# Altium schematic sheet [03] CM4_PART1.SchDoc: Compute Module 4 (CM4)
size A3; Engineer: M. Folejewski; DocumentNumber: 3; SheetNumber: 3; SheetTotal: 5; PageSize: A3; Designators: 100-199
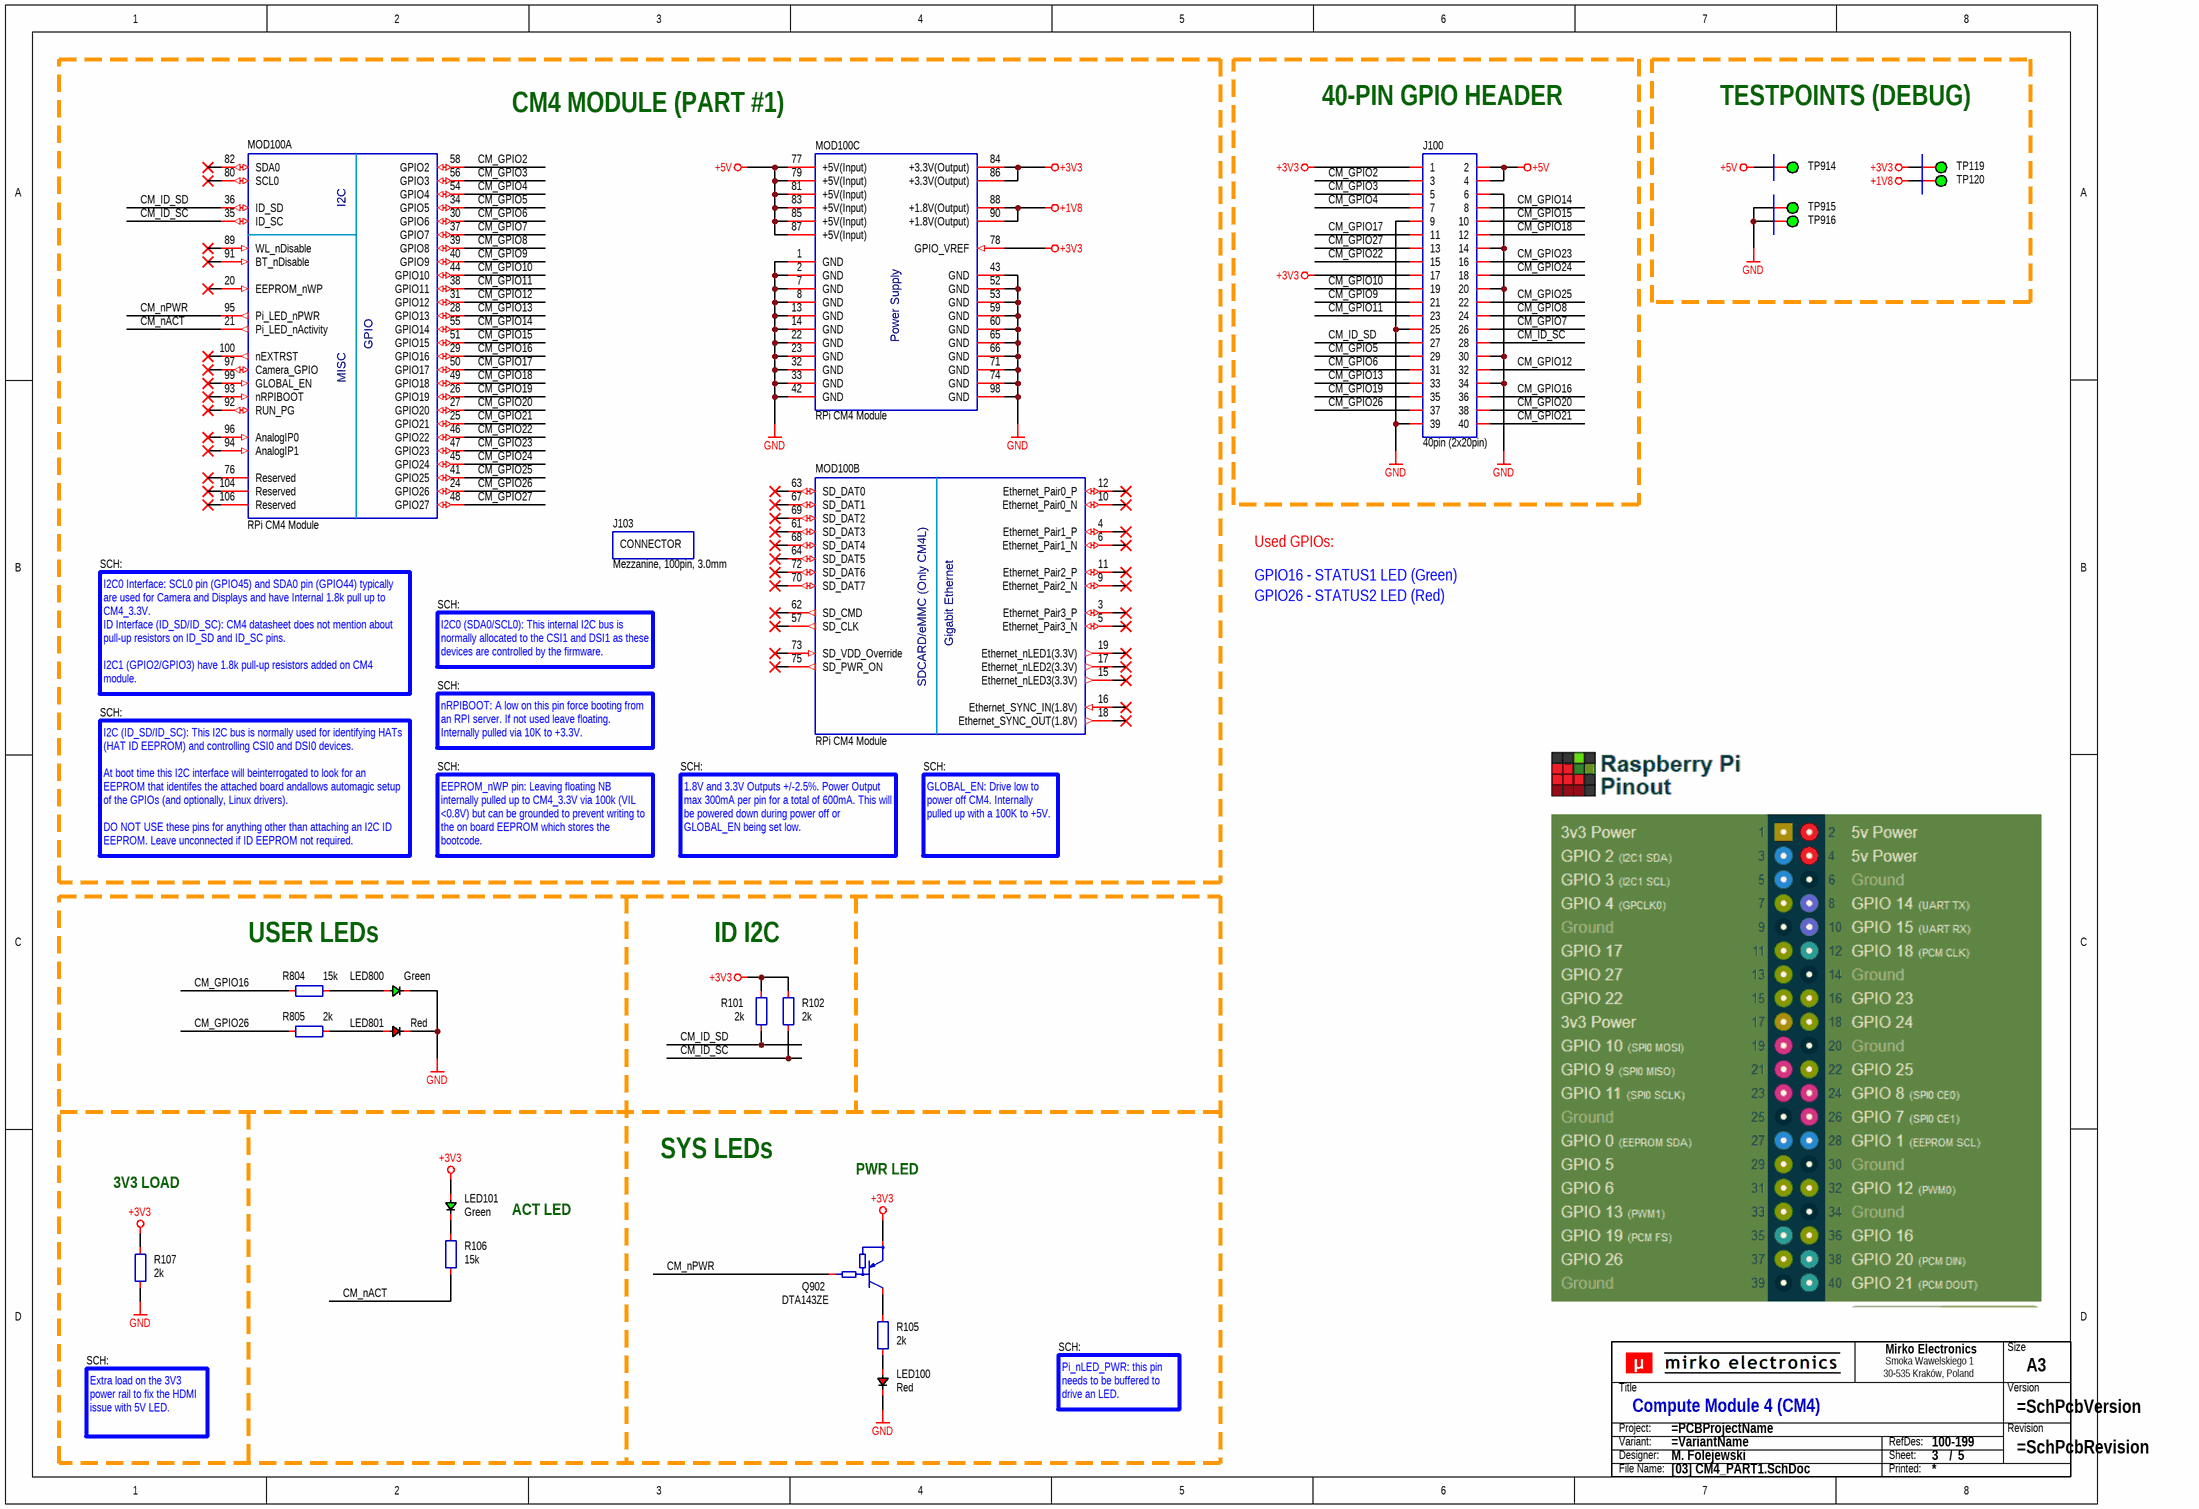
[diagram p0: [03] CM4_PART1.SchDoc]

## Parts
J100  40pin (2x20pin)  [CON_HDR_P254_2X20M_STR]
J103  Mezzanine, 100pin, 3.0mm  [PCB_BLANK_COMP_SMD]
LED100  Red  [LED_0805_RED_R]
LED101  Green  [LED_0805_GRN_R]
LED800  Green  [LED_0805_GRN_R]
LED801  Red  [LED_0805_RED_R]
MOD100  RPi CM4 Module  [MOD_RPI_CM4_P40_C300_CON1]  (parts A,B,C of 3)
Q902  DTA143ZE  [PKG_SOT523_SC75_SOT416_P100_R]
R101  2k  [RES_0603_R]
R102  2k  [RES_0603_R]
R105  2k  [RES_0603_R]
R106  15k  [RES_0603_R]
R107  2k  [RES_0603_R]
R804  15k  [RES_0603_R]
R805  2k  [RES_0603_R]
TB?  Title block  (value not drawn)  (graphical)
TP119  ICT  [PCB_TP_ICT_100]  (value not drawn)  (no BOM)
TP120  ICT  [PCB_TP_ICT_100]  (value not drawn)  (no BOM)
TP914  ICT  [PCB_TP_ICT_100]  (value not drawn)  (no BOM)
TP915  ICT  [PCB_TP_ICT_100]  (value not drawn)  (no BOM)
TP916  ICT  [PCB_TP_ICT_100]  (value not drawn)  (no BOM)

## Nets
+1V8: MOD100.88(+1.8V(Output)) MOD100.90(+1.8V(Output)) TP120.1
+3V3: J100.1 J100.17 LED101.2 MOD100.78(GPIO_VREF) MOD100.84(+3.3V(Output)) MOD100.86(+3.3V(Output)) Q902.2(E) R101.2 R102.2 R107.2 TP119.1
+5V: J100.2 J100.4 MOD100.77(+5V(Input)) MOD100.79(+5V(Input)) MOD100.81(+5V(Input)) MOD100.83(+5V(Input)) MOD100.85(+5V(Input)) MOD100.87(+5V(Input)) TP914.1
GND: J100.6 J100.9 J100.14 J100.20 J100.25 J100.30 J100.34 J100.39 LED100.1 LED800.1 LED801.1 MOD100.1(GND) MOD100.2(GND) MOD100.7(GND) MOD100.8(GND) MOD100.13(GND) MOD100.14(GND) MOD100.22(GND) MOD100.23(GND) MOD100.32(GND) MOD100.33(GND) MOD100.42(GND) MOD100.43(GND) MOD100.52(GND) MOD100.53(GND) MOD100.59(GND) MOD100.60(GND) MOD100.65(GND) MOD100.66(GND) MOD100.71(GND) MOD100.74(GND) MOD100.98(GND) R107.1 TP915.1 TP916.1
CM_GPIO2: J100.3 MOD100.58(GPIO2)
CM_GPIO3: J100.5 MOD100.56(GPIO3)
CM_GPIO4: J100.7 MOD100.54(GPIO4)
CM_GPIO5: J100.29 MOD100.34(GPIO5)
CM_GPIO6: J100.31 MOD100.30(GPIO6)
CM_GPIO7: J100.26 MOD100.37(GPIO7)
CM_GPIO8: J100.24 MOD100.39(GPIO8)
CM_GPIO9: J100.21 MOD100.40(GPIO9)
CM_GPIO10: J100.19 MOD100.44(GPIO10)
CM_GPIO11: J100.23 MOD100.38(GPIO11)
CM_GPIO12: J100.32 MOD100.31(GPIO12)
CM_GPIO13: J100.33 MOD100.28(GPIO13)
CM_GPIO14: J100.8 MOD100.55(GPIO14)
CM_GPIO15: J100.10 MOD100.51(GPIO15)
CM_GPIO16: J100.36 MOD100.29(GPIO16) R804.1
CM_GPIO17: J100.11 MOD100.50(GPIO17)
CM_GPIO18: J100.12 MOD100.49(GPIO18)
CM_GPIO19: J100.35 MOD100.26(GPIO19)
CM_GPIO20: J100.38 MOD100.27(GPIO20)
CM_GPIO21: J100.40 MOD100.25(GPIO21)
CM_GPIO22: J100.15 MOD100.46(GPIO22)
CM_GPIO23: J100.16 MOD100.47(GPIO23)
CM_GPIO24: J100.18 MOD100.45(GPIO24)
CM_GPIO25: J100.22 MOD100.41(GPIO25)
CM_GPIO26: J100.37 MOD100.24(GPIO26) R805.1
CM_GPIO27: J100.13 MOD100.48(GPIO27)
CM_ID_SC: J100.28 MOD100.35(ID_SC) R102.1
CM_ID_SD: J100.27 MOD100.36(ID_SD) R101.1
CM_nACT: MOD100.21(Pi_LED_nActivity) R106.1
CM_nPWR: MOD100.95(Pi_LED_nPWR) Q902.1(B)
NetLED100_2: LED100.2 R105.1
NetLED101_1: LED101.1 R106.2
NetLED800_2: LED800.2 R804.2
NetLED801_2: LED801.2 R805.2
NetQ902_3: Q902.3(C) R105.2

Not connected (* = marked no-connect by the designer): MOD100 3(Ethernet_Pair3_P)* 4(Ethernet_Pair1_P)* 5(Ethernet_Pair3_N)* 6(Ethernet_Pair1_N)* 9(Ethernet_Pair2_N)* 10(Ethernet_Pair0_N)* 11(Ethernet_Pair2_P)* 12(Ethernet_Pair0_P)* 15(Ethernet_nLED3(3.3V))* 16(Ethernet_SYNC_IN(1.8V))* 17(Ethernet_nLED2(3.3V))* 18(Ethernet_SYNC_OUT(1.8V))* 19(Ethernet_nLED1(3.3V))* 20(EEPROM_nWP)* 57(SD_CLK)* 61(SD_DAT3)* 62(SD_CMD)* 63(SD_DAT0)* 64(SD_DAT5)* 67(SD_DAT1)* 68(SD_DAT4)* 69(SD_DAT2)* 70(SD_DAT7)* 72(SD_DAT6)* 73(SD_VDD_Override)* 75(SD_PWR_ON)* 76(Reserved)* 80(SCL0)* 82(SDA0)* 89(WL_nDisable)* 91(BT_nDisable)* 92(RUN_PG)* 93(nRPIBOOT)* 94(AnalogIP1)* 96(AnalogIP0)* 97(Camera_GPIO)* 99(GLOBAL_EN)* 100(nEXTRST)* 104(Reserved)* 106(Reserved)*

## Notes on the sheet
- 40-PIN GPIO HEADER
- TESTPOINTS (DEBUG)
- (near MOD100) CM4 MODULE (PART #1)
- SCH:
- Used GPIOs:
- GPIO16 - STATUS1 LED (Green)
- GPIO26 - STATUS2 LED (Red)
- I2C0 Interface: SCL0 pin (GPIO45) and SDA0 pin (GPIO44) typically are used for Camera and Displays and have Internal 1.8k pull up to CM4_3.3V.
  ID Interface (ID_SD/ID_SC): CM4 datasheet does not mention about pull-up resistors on ID_SD and ID_SC pins.
  I2C1 (GPIO2/GPIO3) have 1.8k pull-up resistors added on CM4 module.
- I2C0 (SDA0/SCL0): This internal I2C bus is normally allocated to the CSI1 and DSI1 as these devices are controlled by the firmware.
- nRPIBOOT: A low on this pin force booting from an RPI server. If not used leave floating. Internally pulled via 10K to +3.3V.
- (near MOD100) SCH:
- I2C (ID_SD/ID_SC): This I2C bus is normally used for identifying HATs (HAT ID EEPROM) and controlling CSI0 and DSI0 devices.
  At boot time this I2C interface will beinterrogated to look for an EEPROM that identifes the attached board andallows automagic setup of the GPIOs (and optionally, Linux drivers).
  DO NOT USE these pins for anything other than attaching an I2C ID EEPROM. Leave unconnected if ID EEPROM not required.
- EEPROM_nWP pin: Leaving floating NB internally pulled up to CM4_3.3V via 100k (VIL <0.8V) but can be grounded to prevent writing to the on board EEPROM which stores the bootcode.
- 1.8V and 3.3V Outputs +/-2.5%. Power Output max 300mA per pin for a total of 600mA. This will be powered down during power off or GLOBAL_EN being set low.
- GLOBAL_EN: Drive low to power off CM4. Internally pulled up with a 100K to +5V.
- USER LEDs
- ID I2C
- 3V3 LOAD
- SYS LEDs
- PWR LED
- ACT LED
- Extra load on the 3V3 power rail to fix the HDMI issue with 5V LED.
- Pi_nLED_PWR: this pin needs to be buffered to drive an LED.
- (in symbol BOM_CON) CONNECTOR
- (in symbol MOD_RPI_CM4_VAR3_CON1, part A) I2C; GPIO; MISC
- (in symbol MOD_RPI_CM4_VAR3_CON1, part B) Gigabit Ethernet; SDCARD/eMMC (Only CM4L)
- (in symbol MOD_RPI_CM4_VAR3_CON1, part C) Power Supply
- (in symbol SCH_TITLE_BLOCK_V1) Mirko Electronics; Size; Smoka Wawelskiego 1; 30-535 Kraków, Poland; Title; Version; Project:; Revision; Variant:; RefDes:; Designer:; Sheet:; /; File Name:; Printed:

## Library data of the parts
J100 = CON_2X20_ROW: Connector; 2 Row;; Manufacturer: GENERIC; Component Subtype: Pin Header; MPN: GENERIC; Value: 40pin (2x20pin); Component Type: Connector; Mounting Type: THT; Supplier: ?
J103 = BOM_CON: BOM list; Connector;; Manufacturer: Hirose; MPN: DF40HC(3.0)-100DS-0.4V; Component Subtype: Microminiature; Package (Case): SMD; Value: Mezzanine, 100pin, 3.0mm; Component Type: Connector; Mounting Type: SMD; Supplier: ?
LED100 LED801 = DIO_LED_RED: Diode; LED; Red;; Manufacturer: Foshan NationStar Optoelectronics; MPN: NCD0805R1; Component Subtype: LED Diode; Package (Case): 0805 (2012); Value: Red; Component Type: LED; Mounting Type: SMD; Supplier: LCSC
LED101 LED800 = DIO_LED_GRN: Diode; LED; Green;; Manufacturer: Foshan NationStar Optoelectronics; MPN: NCD0805G1; Component Subtype: LED Diode; Package (Case): 0805 (2012); Value: Green; Component Type: LED; Mounting Type: SMD; Supplier: LCSC
MOD100 = MOD_RPI_CM4_VAR3_CON1: PCB Module; RPi Compute Module 4; Connector #1 (pins 1-100); Manufacturer: Raspberry Pi Foundation; Component Subtype: Raspberry Pi CM4; Component Type: PCB Module; Mounting Type: -; MPN: CM4 Module; Supplier: ?; Value: RPi CM4 Module
Q902 = TRA_BJT_PNP_DIG_ONS_DTA143ZE: Transistor; BJT; PNP; Digital (Biased);; Manufacturer: On Semiconductor; MPN: DTA143ZET1G; Component Type: Transistor; Mounting Type: SMD; Value: DTA143ZE
R101 R102 R105 R107 R805 = RES-0033: Resistor; Thick Film; 2k2; 1%; 100mW; 100PPM; 75V; Standard; SMD; 0603 (1608);; Manufacturer: Yageo Corporation; MPN: TBD; Component Type: Resistor; Component Subtype: Thick Film; Value: 2k; Mounting Type: SMD; Package (Case): 0603 (1608); Supplier: ?
R106 R804 = RES-0043: Resistor; Thick Film; 15k; 1%; 100mW; 100PPM; 75V; Standard; SMD; 0603 (1608);; Manufacturer: Yageo Corporation; MPN: TBD; Component Type: Resistor; Component Subtype: Thick Film; Value: 15k; Mounting Type: SMD; Package (Case): 0603 (1608); Supplier: ?
TB? = SCH_TITLE_BLOCK_V1: Component Type: Title block; Manufacturer: -; Mounting Type: Non component; MPN: -; Operating Temperature: -; Package: -; Specification: Title block; Value: Title block; Replacement: -; System: ?
TP119 TP120 TP914-TP916 = PCB_TP_ICT: Test Point (ICT); Specification: Testpoint (for ICT), SMD pad; Component Type: Testpoint (for ICT); Manufacturer: -; Mounting Type: Non component; MPN: -; Value: ICT